# EasyEDA Pro project ProPrj_Climate Monitoring_2025-02-02.epro

# Schematic Schematic1
Board Name: Board1; Create Date: 2025-01-09; Page Name: P1; Project Name: Climate Monitoring; Schematic Name: Schematic1; Update Date: 2025-01-10; Company: Kazan Engineering; Page Size: A4; Version: V1.0
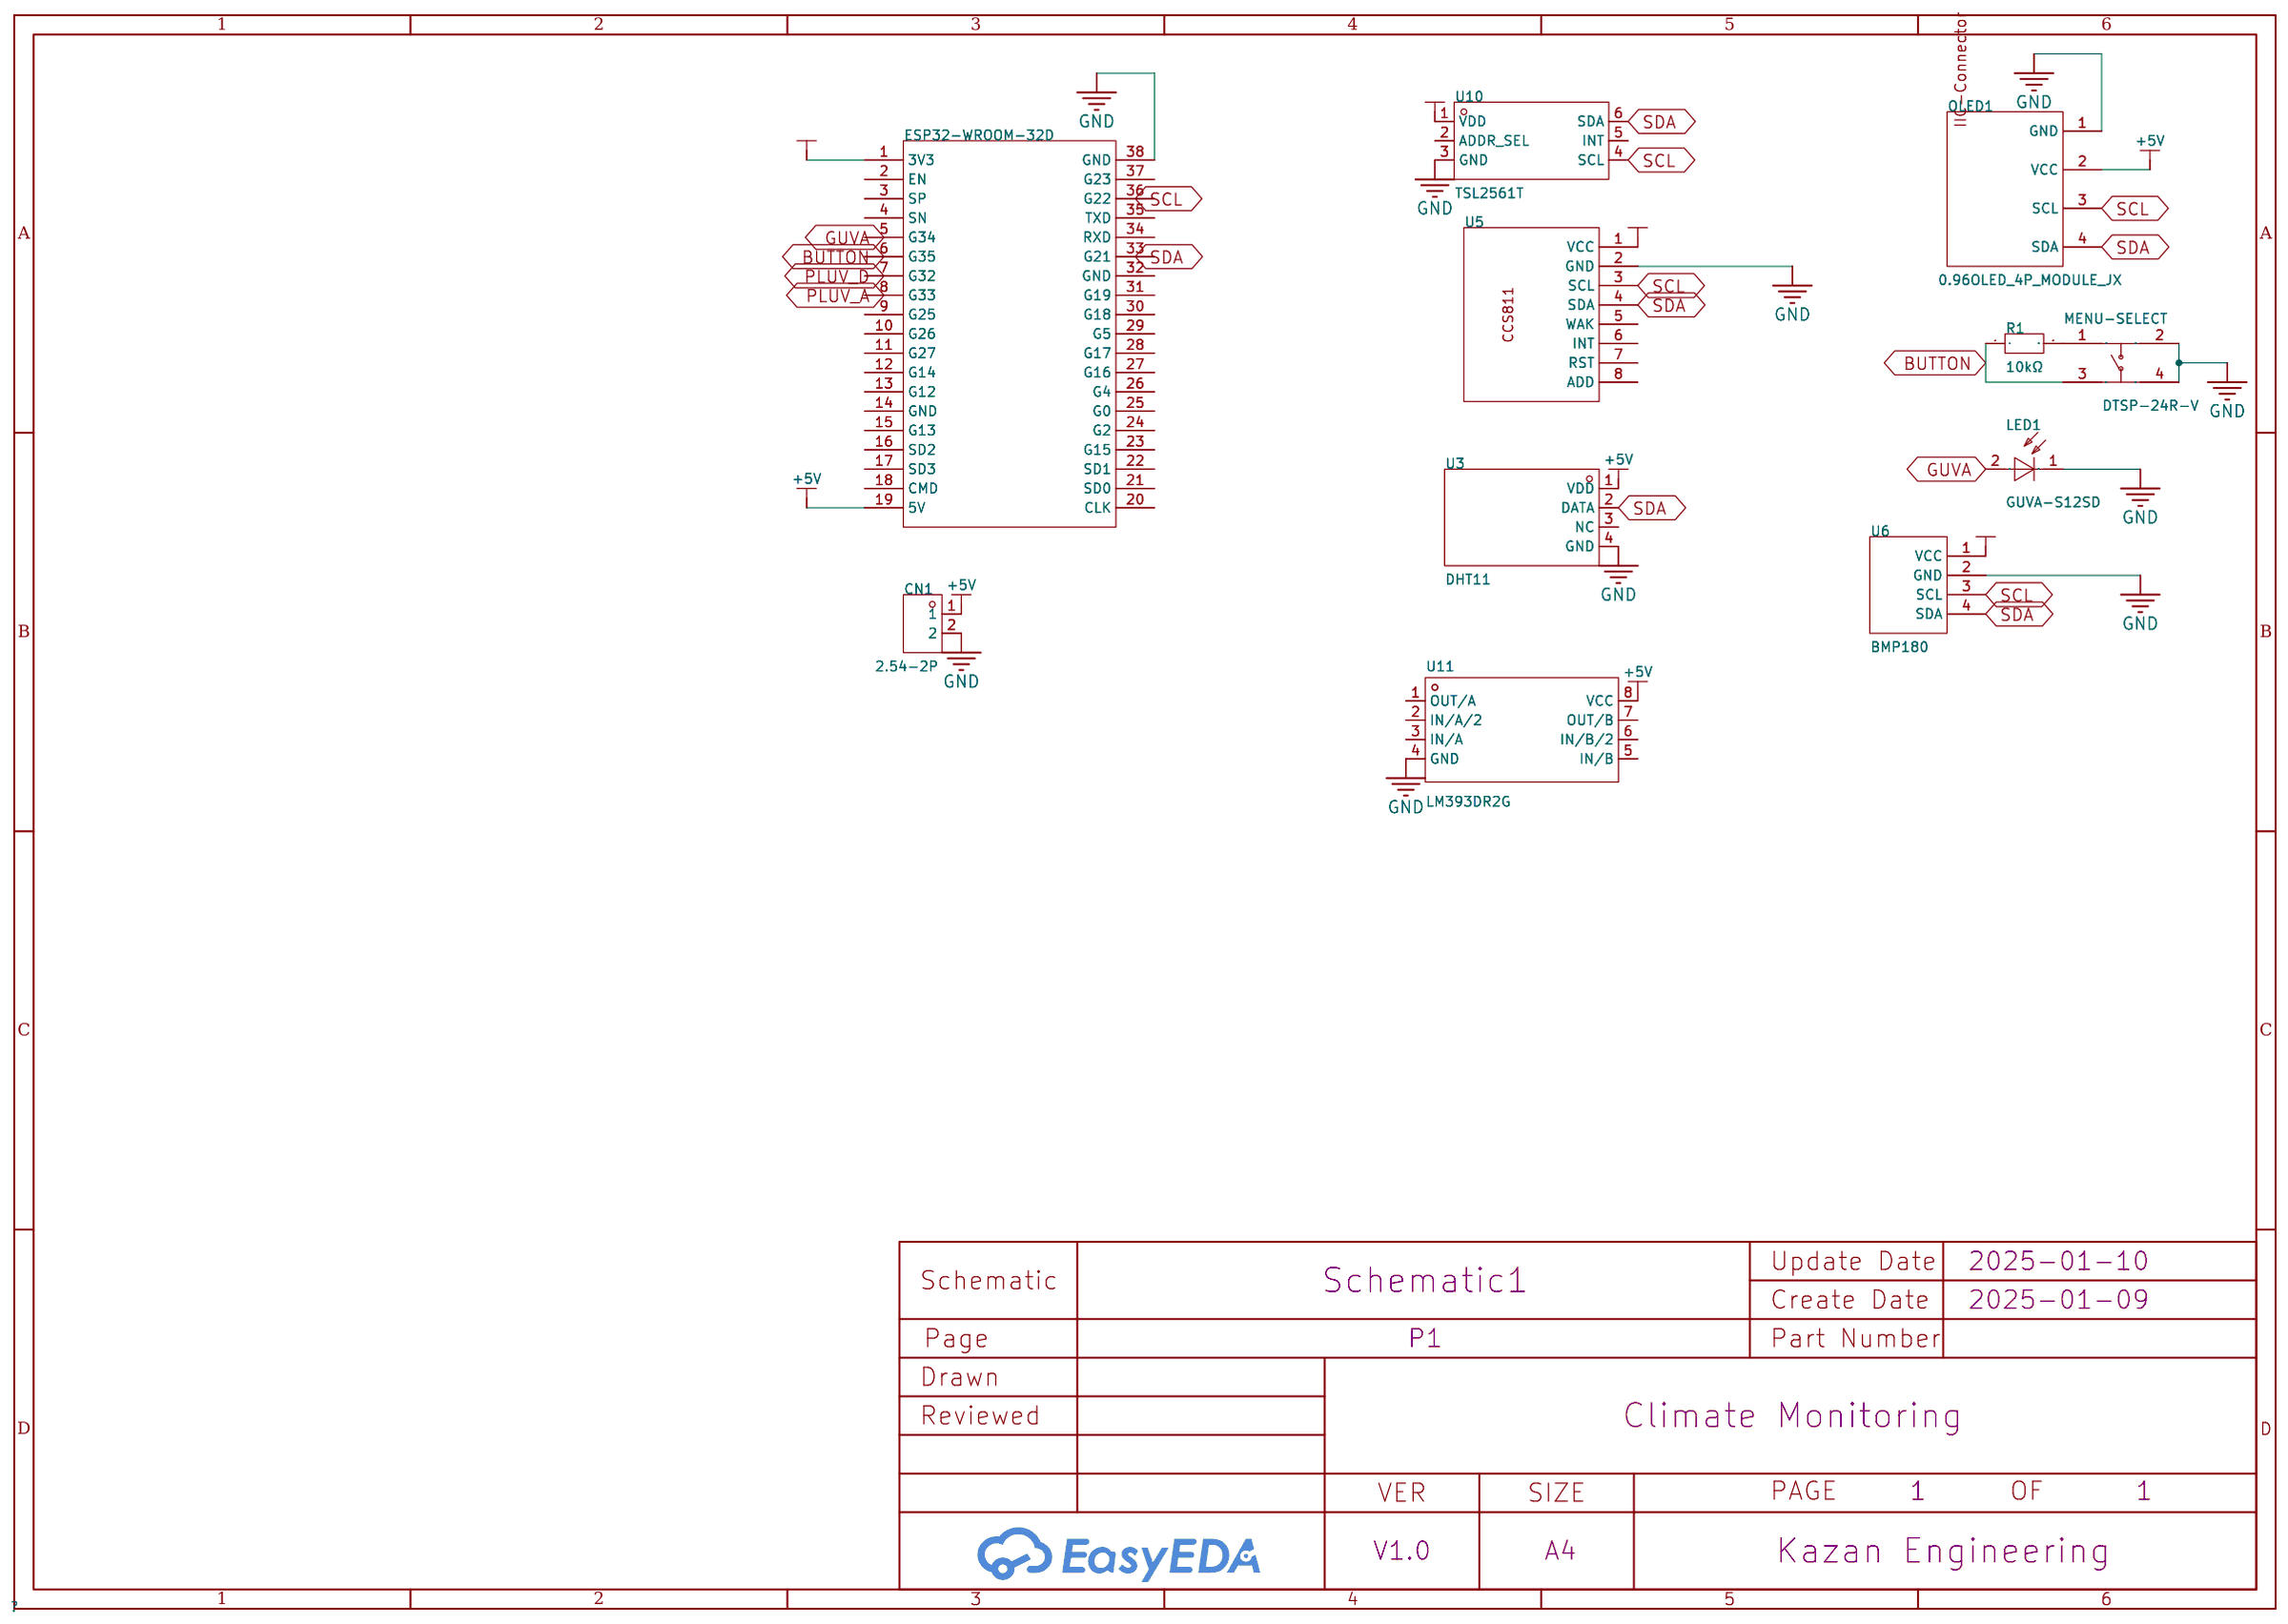
[diagram p0: schematic sheet]

## Parts
CN1  2.54-2P  [CONN-TH_2P-P2.54_C9900022459]
ESP32-WROOM-32D  -  [esp32_38p]
LED1  GUVA-S12SD  [LED-SMD_L3.2-W2.8-RD]
MENU-SELECT  DTSP-24R-V  [SW-TH_4P-L12.0-W12.0-P5.00-LS13.0-EH]
OLED1  0.96OLED_4P_MODULE_JX  [0.96OLED_4P]
R1  10kΩ  [RES-TH_BD2.5-L6.5-P10.50-D0.6]
U3  DHT11  [SENSOR-TH_DHT11]
U5  -  [CCS811]
U6  BMP180  [BMP-180]
U10  TSL2561T  [TMP-6_L3.8-W1.6-P0.90-BL]
U11  LM393DR2G  [SOIC-8_L5.0-W4.0-P1.27-LS6.0-BL]

## Library data of the parts
CN1 = 2.54-2P: Supplier Part: C9900022459; Supplier Footprint: CONN-TH_2P-P2.54; JLCPCB Part Class: Extended Part; Supplier: LCSC
ESP32-WROOM-32D = ESP32_38p開發板
LED1 = GUVA-S12SD: DC Reverse Voltage:5V Spectral Range:240nm~370nm Spectral Range:240nm~370nm Current Dark:1nA Operating Temperature:-30℃~+85℃ Operating Temperature:-30℃~+85℃; Supplier Part: C7200747; Manufacturer: Genicom; Supplier Footprint: SMD3528; Datasheet: https://atta.szlcsc.com/upload/public/pdf/source/20231023/GUVA-S12SD.pdf-addd83c412e655f5b2549c4236bdfba9.pdf; Supplier: LCSC; DC Reverse Voltage: 5V; Spectral Range: 240nm~370nm; Current Dark: 1nA; Operating Temperature: -30℃~+85℃
MENU-SELECT = DTSP-24R-V: Supplier Part: C9900149848; Supplier Footprint: 直插; Supplier: LCSC; Check: true
OLED1 = 0.96OLED_4P_MODULE_JX: Supplier Part: C9900004566; Supplier Footprint: 插件; JLCPCB Part Class: Extended Part; Datasheet: https://atta.szlcsc.comnull; Supplier: LCSC
R1 = PR01000101002JR500: Type:Metal Film Resistors Resistance: Tolerance:±5% Tolerance:±5% Power(Watts):1W Temperature Coefficient:±250ppm/℃ Temperature Coefficient:±250ppm/℃ Operating Temperature Range:-55℃~+155℃ Operating Temperature Range:-55℃~+155℃; LCSC Part Name: 金属膜电阻 10kΩ ±5% 1W; Supplier Part: C1740481; Manufacturer: VISHAY(威世); Supplier Footprint: 插件,D2.5xL6.5mm; JLCPCB Part Class: Extended Part; Datasheet: https://atta.szlcsc.com/upload/public/pdf/source/20210602/6D62266A55AD0061A6CD57B448BC339E.pdf; Supplier: LCSC; Type: Metal Film Resistors; Tolerance: ±5%; Power(Watts): 1W; Temperature Coefficient: ±250ppm/℃; Operating Temperature Range: -55℃~+155℃; Check: true
U3 = DHT11_C117051: LCSC Part Name: DHT11  电容式传感器 新款电容式数字温湿度传感器,老款已停产16.1x12.6x5.8mm; Supplier Part: C117051; Manufacturer: 广州奥松; Supplier Footprint: SIP-4; JLCPCB Part Class: Extended Part; Datasheet: https://atta.szlcsc.com/upload/public/pdf/source/20170703/1499081238365.pdf; Supplier: LCSC
U5 = CCS811
U6 = BMP180: 3DModel: BMP180V1 COPY COPY COPY
U10 = TSL2561T: LCSC Part Name: 光强度数字转换器 停产; Supplier Part: C481878; Manufacturer: ams(艾迈斯半导体); Supplier Footprint: TMB-6; Datasheet: https://atta.szlcsc.com/upload/public/pdf/source/20200113/C481878_838A10DFFA693EDB55686851A6B42A00.pdf; Supplier: LCSC
U11 = LM393DR2G: Input Offset Voltage (Vos):5mV Input Bias Current (Ib):250nA Input Hysteresis Voltage (Vhys):- Common Mode Rejection Ratio (CMRR):- Supply Voltage:1V~18V；2V~36V Supply Voltage:1V~18V；2V~36V Output Type:Open set Output Mode:- Supply Current:2.5mA Operating; Supplier Part: C7955; Manufacturer: onsemi(安森美); Supplier Footprint: SOIC-8; JLCPCB Part Class: Basic Part; Datasheet: https://atta.szlcsc.com/upload/public/pdf/source/20140815/1457707223499.pdf; Supplier: LCSC; Input Offset Voltage (Vos): 5mV; Input Bias Current (Ib): 250nA; Supply Voltage: 1V~18V；2V~36V; Output Type: Open set; Supply Current: 2.5mA; Operating Temperature: 0℃~+70℃

## Nets
+3.3V: ESP32-WROOM-32D.1(3V3) U5.1(VCC) U6.1(VCC) U10.1(VDD)
+5V: CN1.1 ESP32-WROOM-32D.19(5V) OLED1.2(VCC) U3.1(VDD) U11.8(VCC)
GND: CN1.2 ESP32-WROOM-32D.38(GND) LED1.1(C) MENU-SELECT.2 MENU-SELECT.4 OLED1.1(GND) U3.4(GND) U5.2(GND) U6.2(GND) U10.3(GND) U11.4(GND)
BUTTON: ESP32-WROOM-32D.6(G35) MENU-SELECT.3 R1.1
GUVA: ESP32-WROOM-32D.5(G34) LED1.2(A)
PLUV_A: ESP32-WROOM-32D.8(G33)
PLUV_D: ESP32-WROOM-32D.7(G32)
SCL: ESP32-WROOM-32D.36(G22) OLED1.3(SCL) U5.3(SCL) U6.3(SCL) U10.4(SCL)
SDA: ESP32-WROOM-32D.33(G21) OLED1.4(SDA) U3.2(DATA) U5.4(SDA) U6.4(SDA) U10.6(SDA)
$1N3026: MENU-SELECT.1 R1.2

Not connected (* = marked no-connect by the designer): ESP32-WROOM-32D 2(EN) 3(SP) 4(SN) 9(G25) 10(G26) 11(G27) 12(G14) 13(G12) 14(GND) 15(G13) 16(SD2) 17(SD3) 18(CMD) 20(CLK) 21(SD0) 22(SD1) 23(G15) 24(G2) 25(G0) 26(G4) 27(G16) 28(G17) 29(G5) 30(G18) 31(G19) 32(GND) 34(RXD) 35(TXD) 37(G23); U3 3(NC); U5 5(WAK) 6(INT) 7(RST) 8(ADD); U10 2(ADDR SEL) 5(INT); U11 1(OUT/A) 2(IN/A/2) 3(IN/A) 5(IN/B) 6(IN/B/2) 7(OUT/B)

# Board PCB1
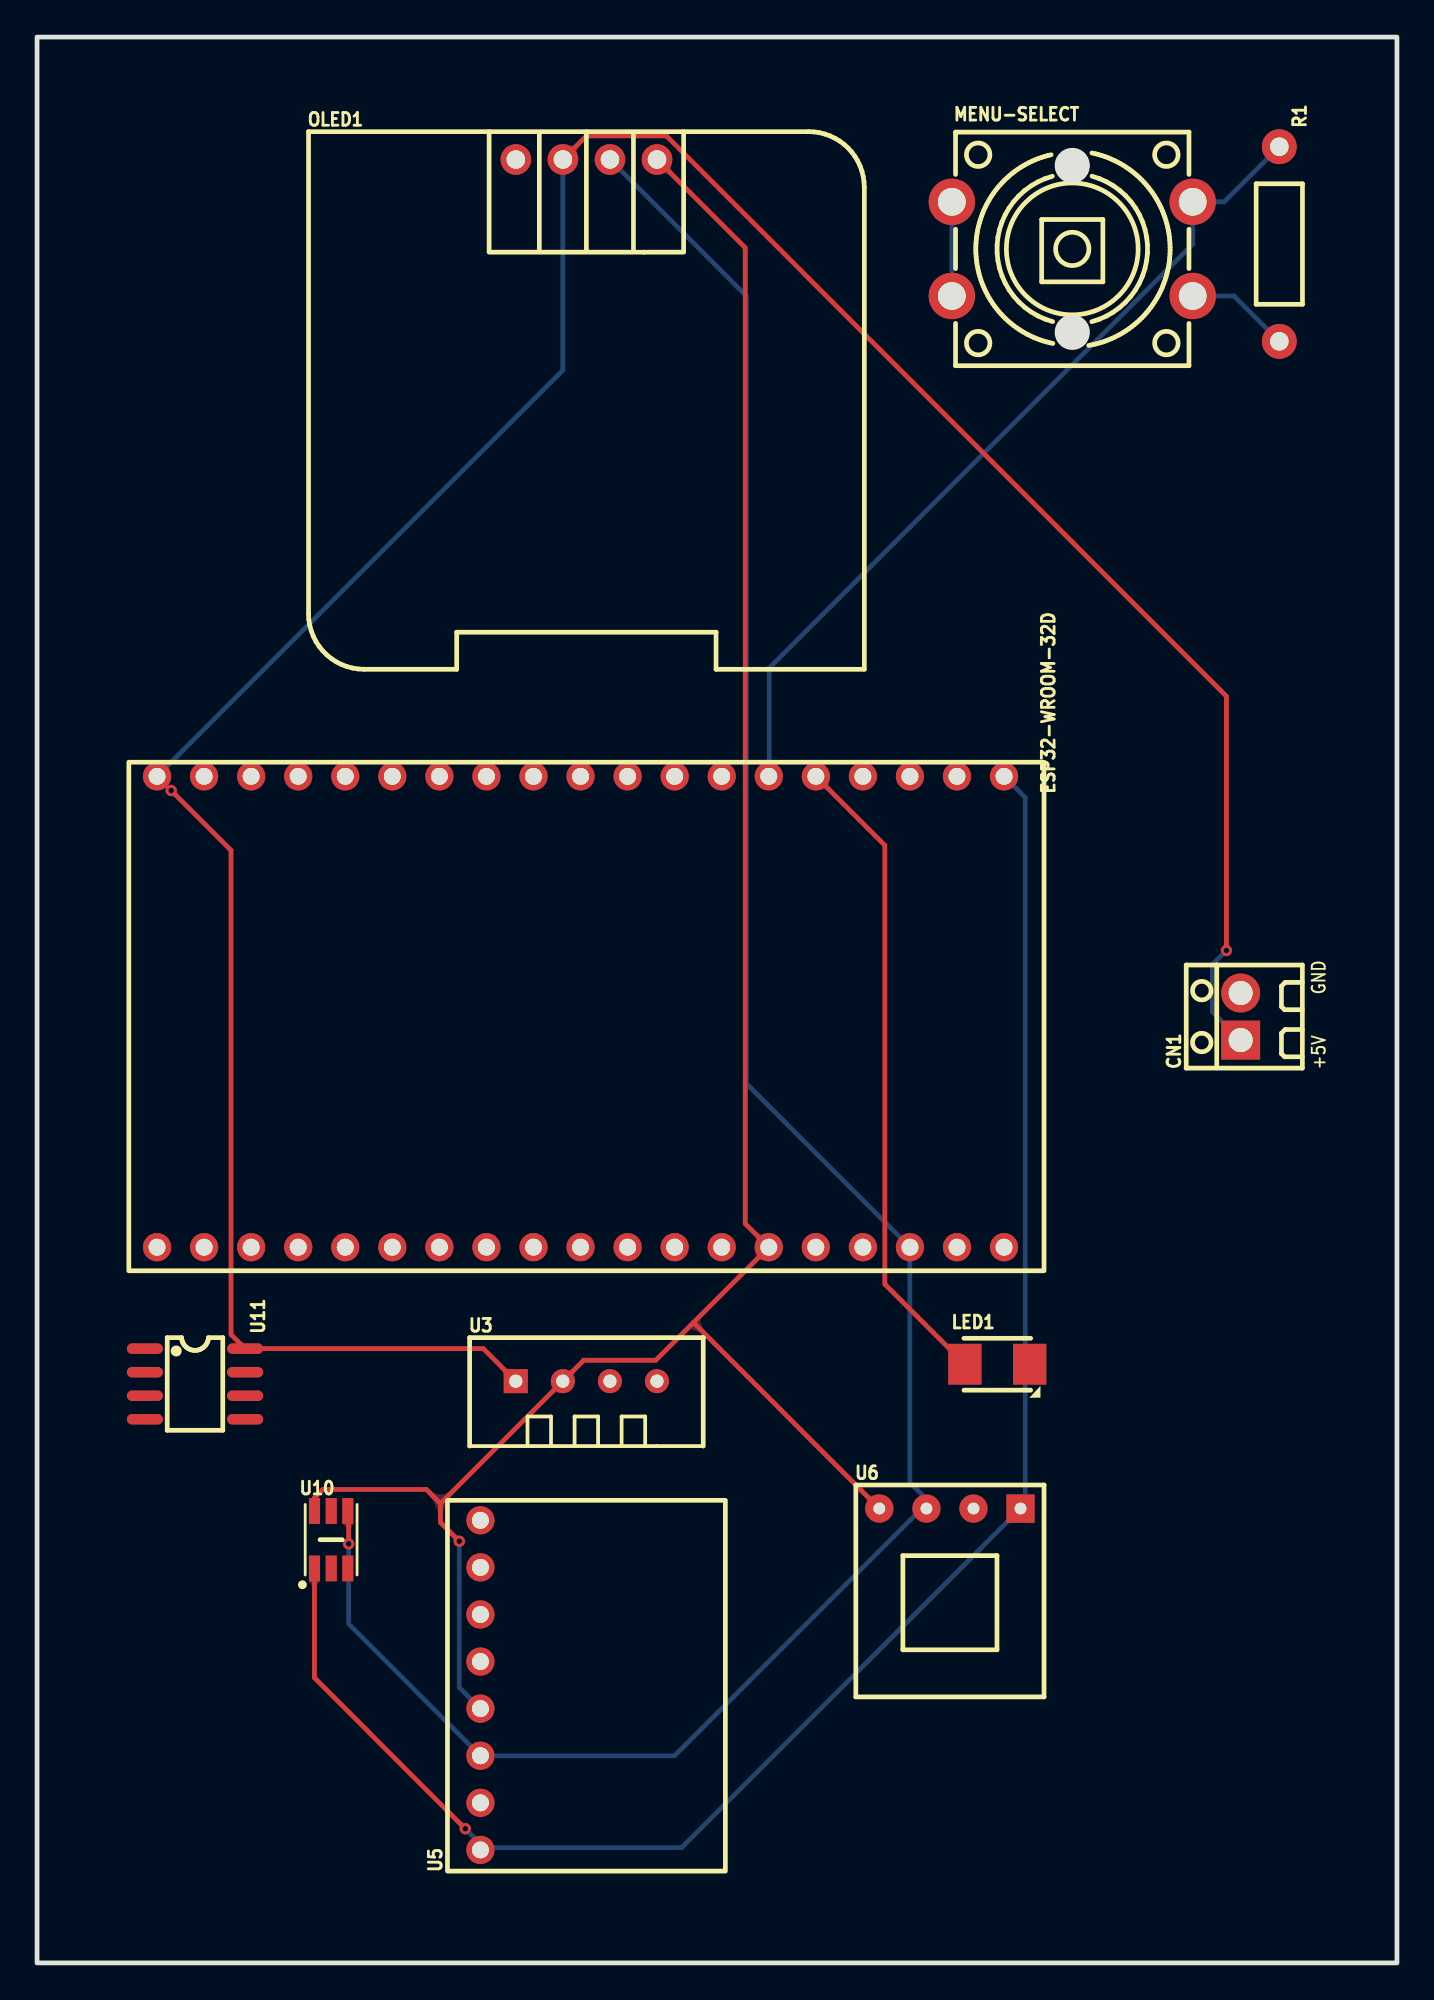
[diagram p1: board, top side]
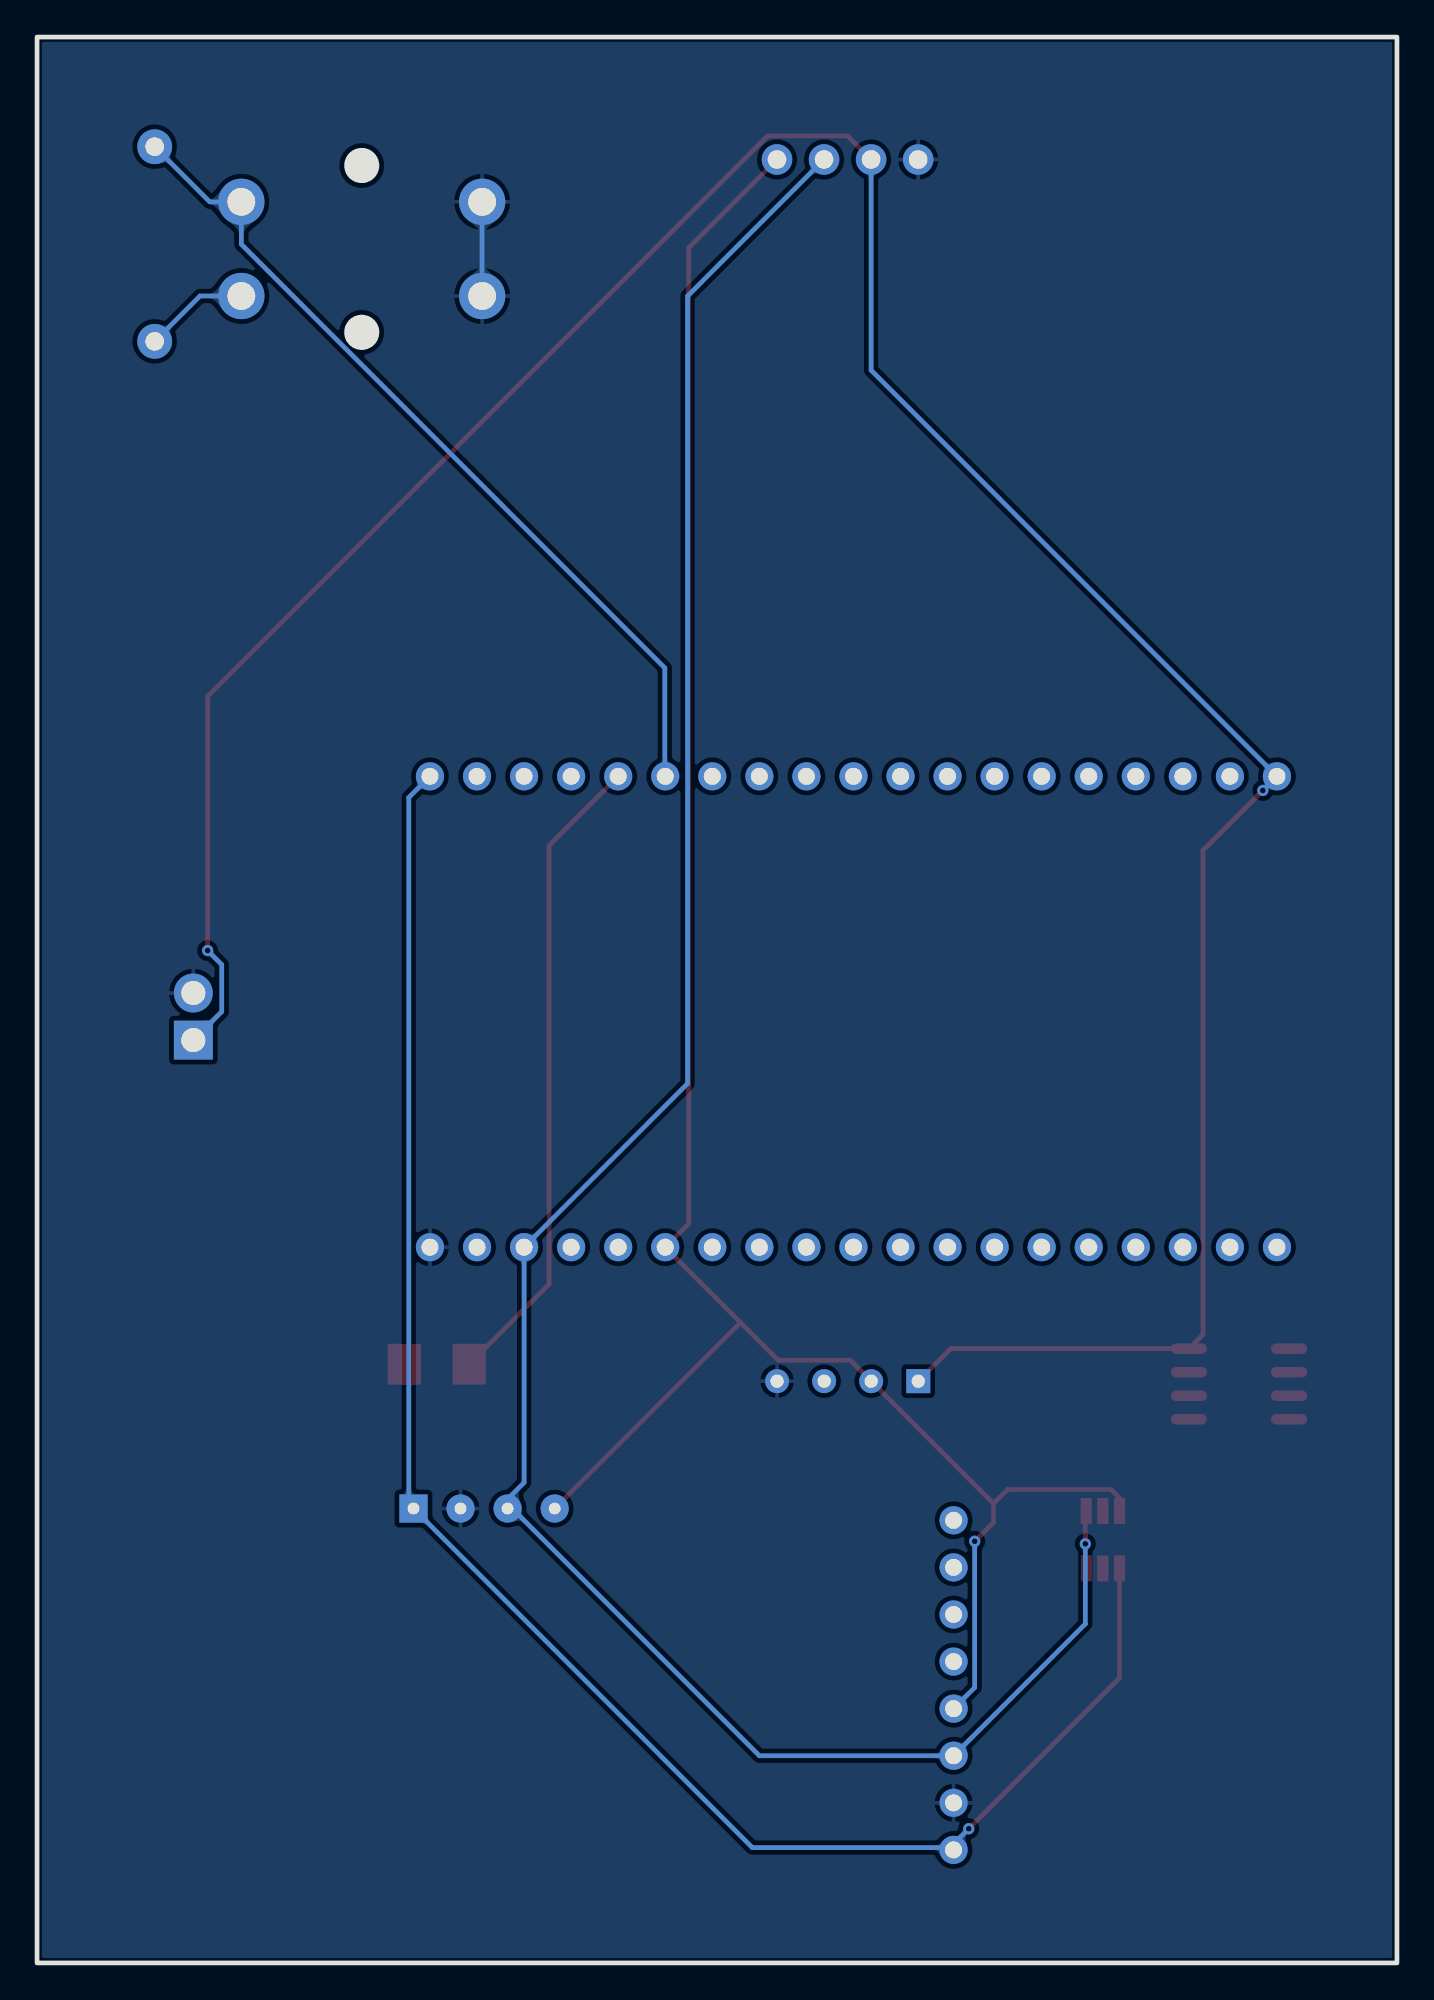
[diagram p2: board, bottom side, seen from below]

Outline 73.41 x 103.89 mm; copper layers: Top Layer, Bottom Layer. Coordinates in mm from the lower left corner of the outline.
Outline path: rectangle 0,103.89 73.41,0
Stack: Top Layer 0.035mm / Dielectric1 1.51mm FR4 er 4.5 / Bottom Layer 0.035mm

## Design rules (mm)
template: JLCPCB Capability(Two Layers Board)
spacing copperThickness1oz (default): track to track 0.102, other pairs 0.152 to 0.3
spacing copperThickness2oz: track to track 0.203, other pairs 0.152 to 0.3
track width copperThickness1oz (default): min 0.127, default 0.254, max 2.54
track width copperThickness2oz: min 0.203, default 0.254, max 2.54
differential pair differentialPair (default): width min 0.127, default 0.254, max 2.54; gap min 0.152, default 0.152
via viaSize (default): diameter min 0.5, default 0.61, max 10; hole min 0.3, default 0.305, max 6.3

## Placement (name value [footprint] x y rotation side)
CN1  2.54-2P  [CONN-TH_2P-P2.54_C9900022459]  64.97 51.05 90 top
ESP32-WROOM-32D  -  [esp32_38p]  6.48 64.01 270 top
LED1  GUVA-S12SD  [LED-SMD_L3.2-W2.8-RD]  51.83 32.3 180 top
MENU-SELECT  DTSP-24R-V  [SW-TH_4P-L12.0-W12.0-P5.00-LS13.0-EH]  55.88 92.46 180 top
OLED1  0.96OLED_4P_MODULE_JX  [0.96OLED_4P]  29.65 97.28 0 top
R1  10kΩ  [RES-TH_BD2.5-L6.5-P10.50-D0.6]  67.06 92.72 270 top
U3  DHT11  [SENSOR-TH_DHT11]  29.65 31.38 0 top
U5  -  [CCS811]  29.01 15.11 90 top
U6  BMP180  [BMP-180]  49.28 19.43 0 top
U10  TSL2561T  [TMP-6_L3.8-W1.6-P0.90-BL]  15.87 22.83 0 top
U11  LM393DR2G  [SOIC-8_L5.0-W4.0-P1.27-LS6.0-BL]  8.53 31.23 270 top

## Footprints (pads in the part's own frame, mm; a bottom-side part is the same pattern mirrored in y, then rotated)
0.96OLED_4P
  round 1.65 hole 1: 1(-3.81,-0.002) 2(-1.27,0.002) 3(1.27,0.002) 4(3.81,0.002)
BMP-180
  rect 1.524x1.524 hole 0.635: 1(3.81,5.08)
  round 1.524 hole 0.635: 2(1.27,5.08) 3(-1.27,5.08) 4(-3.81,5.08)
CCS811
  round 1.524 hole 0.914: 1(-9.017,5.08) 2(-6.477,5.08) 3(-3.937,5.08) 4(-1.397,5.08) 5(1.143,5.08) 6(3.683,5.08) 7(6.223,5.08) 8(8.763,5.08)
CONN-TH_2P-P2.54_C9900022459
  rect 2.1x2.1 hole 1.3: 1(-1.27,0)
  round 2.1 hole 1.3: 2(1.27,0)
esp32_38p
  round 1.524 hole 0.914: 1(0,45.72) 2(0,43.18) 3(0,40.64) 4(0,38.1) 5(0,35.56) 6(0,33.02) 7(0,30.48) 8(0,27.94) 9(0,25.4) 10(0,22.86) 11(0,20.32) 12(0,17.78) 13(0,15.24) 14(0,12.7) 15(0,10.16) 16(0,7.62) 17(0,5.08) 18(0,2.54) 19(0,0) 20(25.4,0) 21(25.4,2.54) 22(25.4,5.08) 23(25.4,7.62) 24(25.4,10.16) 25(25.4,12.7) 26(25.4,15.24) 27(25.4,17.78) 28(25.4,20.32) 29(25.4,22.86) 30(25.4,25.4) 31(25.4,27.94) 32(25.4,30.48) 33(25.4,33.02) 34(25.4,35.56) 35(25.4,38.1) 36(25.4,40.64) 37(25.4,43.18) 38(25.4,45.72)
LED-SMD_L3.2-W2.8-RD
  rect 1.8x2.2 smd: 1(-1.75,0) 2(1.75,0)
RES-TH_BD2.5-L6.5-P10.50-D0.6
  round 1.879 hole 1: 1(-5.25,0) 2(5.25,0)
SENSOR-TH_DHT11
  rect 1.296x1.296 hole 0.711: 1(-3.81,0)
  round 1.296 hole 0.711: 2(-1.27,0) 3(1.27,0) 4(3.81,0)
SOIC-8_L5.0-W4.0-P1.27-LS6.0-BL
  oval 0.569x1.95 smd: 1(-1.905,-2.705) 2(-0.635,-2.705) 3(0.635,-2.705) 4(1.905,-2.705) 5(1.905,2.705) 6(0.635,2.705) 7(-0.635,2.705) 8(-1.905,2.705)
SW-TH_4P-L12.0-W12.0-P5.00-LS13.0-EH
  round 2.5 hole 1.5: 1(-6.5,2.54) 2(6.5,2.54) 3(-6.5,-2.54) 4(6.5,-2.54)
TMP-6_L3.8-W1.6-P0.90-BL
  rect 0.6x1.4 smd: 1(-0.9,-1.55) 2(0,-1.55) 3(0.9,-1.55) 4(0.9,1.55) 5(0,1.55) 6(-0.9,1.55)

## Nets
As in the schematic.

Pads without a net: ESP32-WROOM-32D 2 3 4 9 10 11 12 13 14 15 16 17 18 20 21 22 23 24 25 26 27 28 29 30 31 32 34 35 37; U3 3; U5 5 6 7 8; U10 2 5; U11 1 2 3 5 6 7

## Via types
v1: diameter 0.61, hole 0.305, Top Layer to Bottom Layer, 5 vias

## Routing (per net, layer and track width the routed paths; a pad name or vN(x,y) marks a point on that pad's centre or on a via; arc(x,y) is an arc through that point)
+3.3V: length 95.7
  Top Layer w0.254: 14.98,21.28 14.98,15.38 v1(23.11,7.24)
  Bottom Layer w0.254: 24.13,6.22 34.8,6.22 U6.1 53.34,24.77 53.34,62.86 ESP32-WROOM-32D.1 ; 24.13,6.22 v1(23.11,7.24) ; 24.13,6.22 24.06,6.22 U5.1
+5V: length 158.9
  Top Layer w0.254: OLED1.2 29.65,98.55 33.97,98.55 64.2,68.33 v1(64.2,54.61) ; v1(7.24,63.25) 10.47,60.02 10.47,33.9 11.23,33.14 24.08,33.14 U3.1
  Bottom Layer w0.254: v1(64.2,54.61) 63.44,53.85 63.44,51.31 CN1.1 ; v1(7.24,63.25) ESP32-WROOM-32D.19 28.38,85.92 OLED1.2
GND: length 5.1
  Bottom Layer w0.254: MENU-SELECT.2 MENU-SELECT.4
BUTTON: length 46.4
  Bottom Layer w0.254: ESP32-WROOM-32D.6 39.52,64.03 39.52,69.85 62.38,92.71 MENU-SELECT.3 64.08,95 67.06,97.97
GUVA: length 35
  Top Layer w0.254: ESP32-WROOM-32D.5 45.77,60.28 45.77,36.61 LED1.2
SCL: length 125.5
  Top Layer w0.254: v1(16.82,22.61) 16.82,24.33 16.77,24.38
  Bottom Layer w0.254: v1(16.82,22.61) 16.82,18.29 U5.3 34.42,11.18 47.88,24.64 ; 47.88,24.64 U6.3 ; 47.88,24.64 47.88,25.15 47.12,25.91 ESP32-WROOM-32D.36 38.29,47.43 38.29,89.92 OLED1.3
SDA: length 118.8
  Top Layer w0.254: 35.43,34.54 ESP32-WROOM-32D.33 38.23,39.88 38.23,92.52 OLED1.4 ; 35.43,34.54 U6.4 ; 35.43,34.54 33.4,32.51 29.51,32.51 U3.2 21.78,24.78 ; 14.98,24.38 14.98,25.09 15.43,25.54 21.01,25.54 21.78,24.78 ; v1(22.79,22.75) 21.78,23.76 21.78,24.78
  Bottom Layer w0.254: U5.4 22.79,14.86 v1(22.79,22.75)
$1N3026: length 5.7
  Bottom Layer w0.254: MENU-SELECT.1 64.61,89.92 R1.2

## Copper pours and planes (outline as drawn; the poured copper is in the pictures)
GND on Top Layer: 0,104.1 73.86,104.1 73.86,0 0,0
GND on Bottom Layer: 0,103.89 73.41,103.89 73.41,0 0,0

Small or netless copper shapes (teardrops, artwork), in the pictures only: 22 on Top Layer, 30 on Bottom Layer

## Text on the board
Top Silkscreen Layer: GND | +5V
